# Altium schematic sheet MainBoard_V100_PSU_5V.SchDoc
size A4; SheetNumber: 8; SheetTotal: 22; Title_: +5V Power Supply
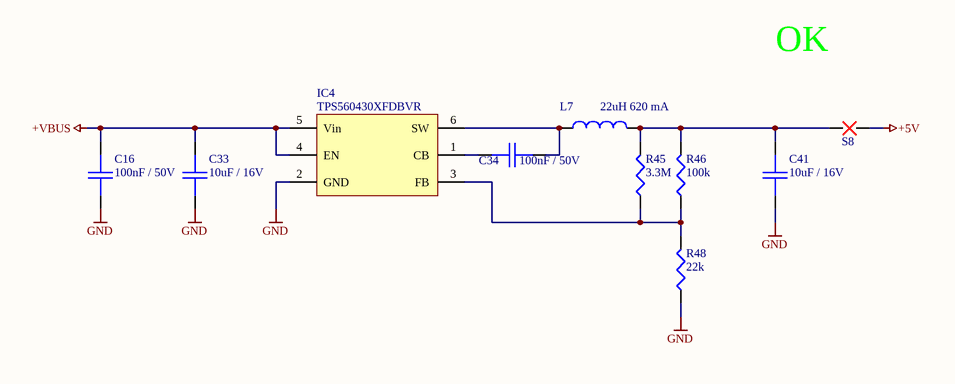
[diagram p0: MainBoard_V100_PSU_5V.SchDoc]

## Parts
C16  100nF / 50V  [0805_C]
C33  10uF / 16V  [0805_C]
C34  100nF / 50V  [0805_C]
C41  10uF / 16V  [0805_C]
IC4  TPS560430XFDBVR  [SOT-23-6]
L7  22uH 620 mA  [1210]
R45  3.3M  [0805]
R46  100k  [0805]
R48  22k  [0805]
S8  SPLITER  [SPLITER2_30mil_9mil]  (value not drawn)  (no BOM)

## Nets
+5V: S8.2
+VBUS: C16.1 C33.1 IC4.4(EN) IC4.5(Vin)
GND: C16.2 C33.2 C41.2 IC4.2(GND) R48.1
NetC34_1: C34.1 IC4.1(CB)
NetC34_2: C34.2 IC4.6(SW) L7.1
NetC41_1: C41.1 L7.2 R45.2 R46.2 S8.1
NetIC4_3: IC4.3(FB) R45.1 R46.1 R48.2

## Notes on the sheet
- OK
- Board:
- Author:
- Title:
- Project:
- SVN:
- Version:
- Sheet:
- of
- Contact:
- Modified:
- Size:
- A4

## Library data of the parts
C16 C34 = 149: 100nF 50V X7R; Part Number: SMD0805-100nF-50V; Azonosító: 149; Category: Passives; Subcategory: PASS_Capacitor; Supplier 1: HESTORE; Supplier 1 order number: 100.011.22
C33 C41 = 153: 10uF 16V X5R; Part Number: SMD0805-10uF-16V; Azonosító: 153; Category: Passives; Subcategory: PASS_Capacitor; Supplier 1: HESTORE; Supplier 1 order number: 100.344.52
IC4 = 192: SIMPLE SWITCHER 4-V to 36-V, 600-mA Synchronous Step-Down Converter; Azonosító: 192; Part Number: TPS560430XFDBVR; Category: Integrated Circuits; Subcategory: ICs__Power; Supplier 1: MOUSER; Supplier 1 order number: 595-TPS560430XFDBVR; Supplier 2: DIGIKEY; Supplier 2 order number: 296-52607-1-ND; Help URL: https://www.ti.com/general/docs/suppproductinfo.tsp?distId=26&gotoUrl=https://www.ti.com/lit/gpn/tps560430
L7 = 387: 22uH 620 mA 1210; Part Number: CBC3225T220KR; Azonosító: 387; Category: Passives; Subcategory: PASS_Inductor; Supplier 1: MOUSER; Supplier 1 order number: 963-CBC3225T220KR; Help URL: https://hu.mouser.com/datasheet/2/396/wound02_e-2256580.pdf
R45 = 72: 3.3M 0805 0.125W 5%; Part Number: SMD0805-3.3M 5%; Azonosító: 72; Category: Passives; Subcategory: PASS_Resistor; Supplier 1: HESTORE; Supplier 1 order number: 100.320.32
R46 = 66: 100k 0805 0.125W 5%; Part Number: SMD0805-100k 5%; Azonosító: 66; Category: Passives; Subcategory: PASS_Resistor; Supplier 1: HESTORE; Supplier 1 order number: 100.011.43
R48 = 388: 22k 0805 0.1W 5%; Part Number: SMD0805-22k-5%; Azonosító: 388; Category: Passives; Subcategory: PASS_Resistor; Supplier 1: HESTORE; Supplier 1 order number: 100.011.64
S8 = 272: SPLITER2_30mil_9mil; Azonosító: 272; Part Number: SPLITER2_30mil_9mil; Category: Accessories; Subcategory: ACCE_Other